# EAGLE schematic ft231x-breakout-v11 (EAGLE 8.6.3)
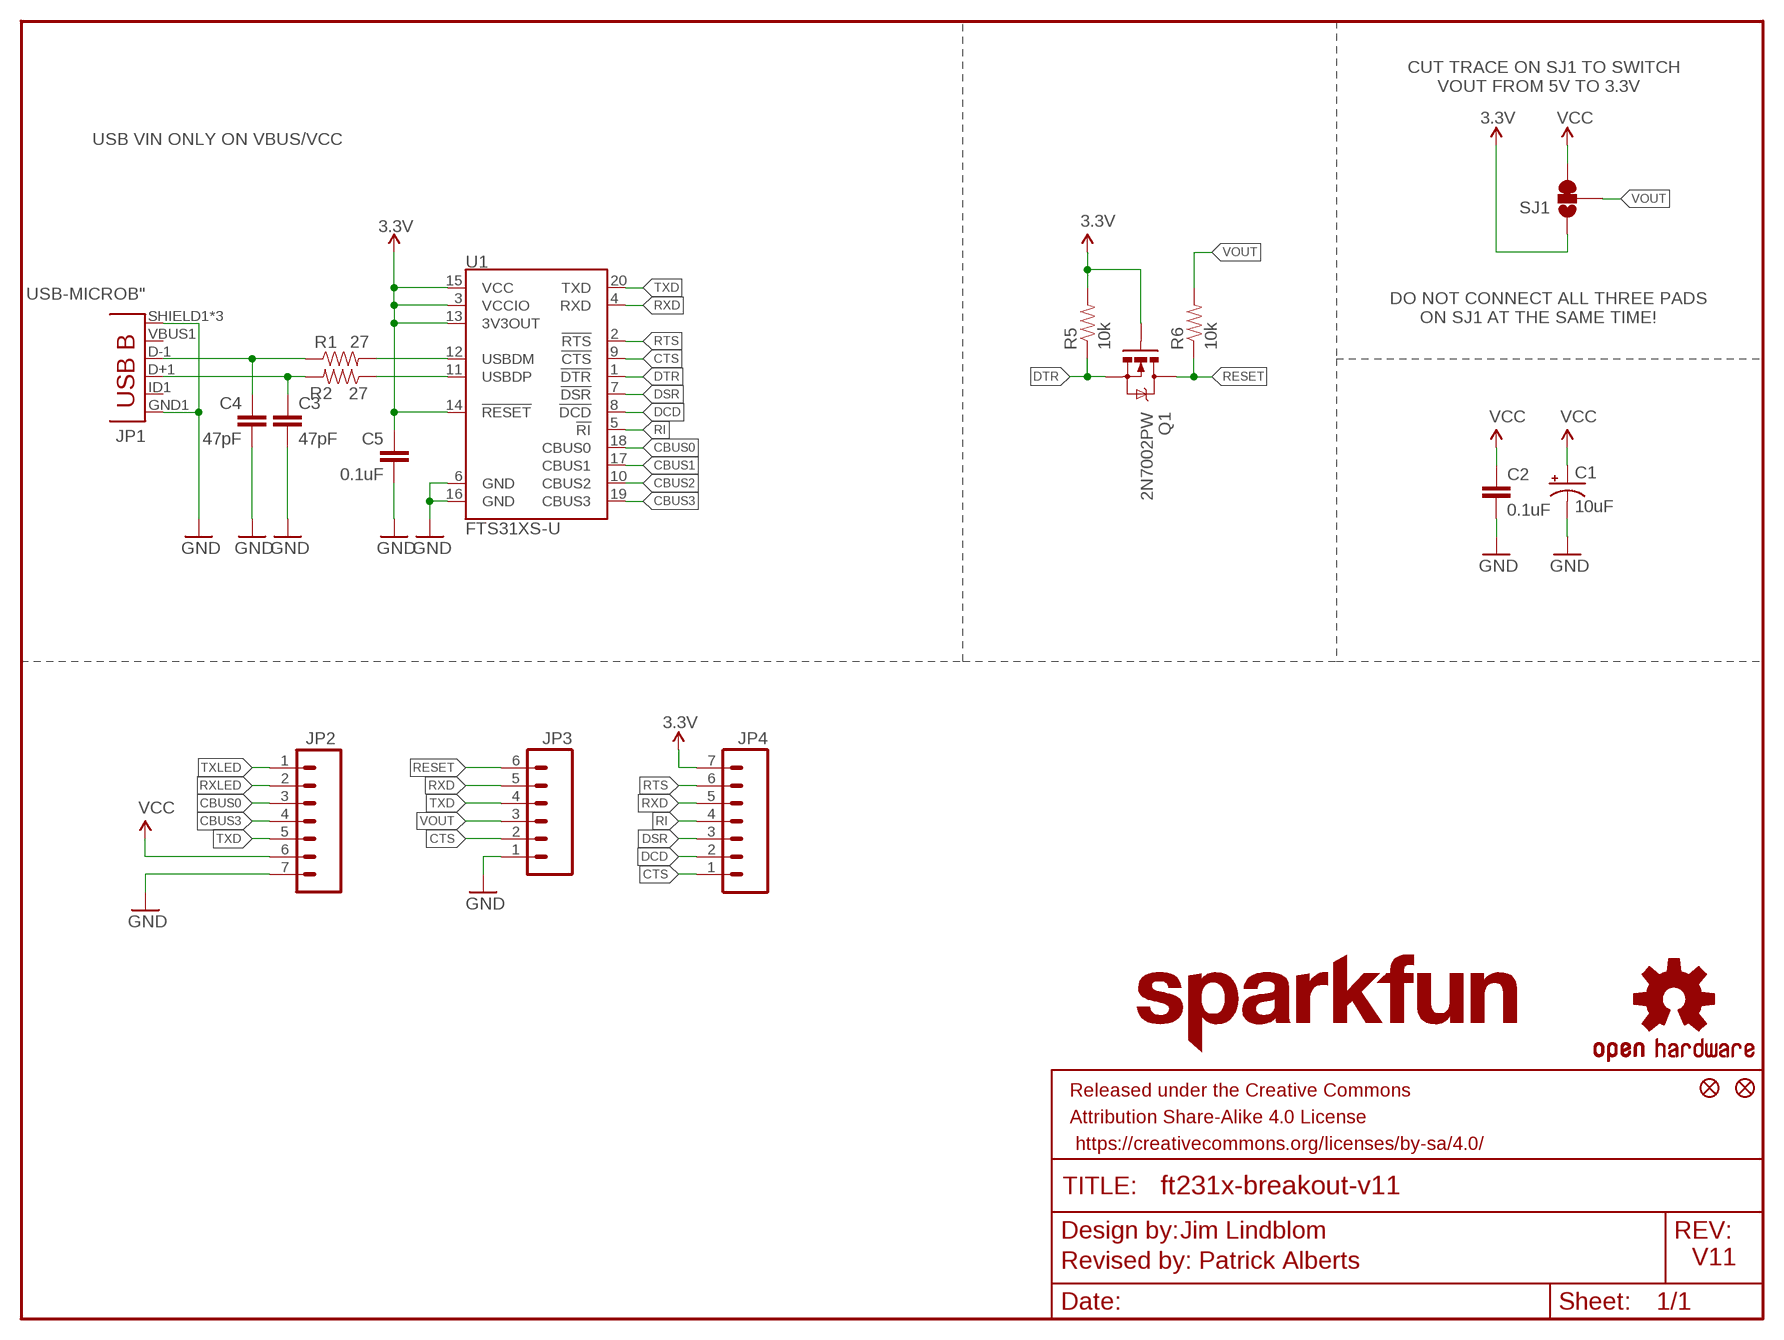
[diagram p0: schematic, sheet 1]

## Parts
C1  10uF  10UF-16V-10%(TANT)  [EIA3216]
C2  0.1uF  0.1UF-25V(+80/-20%)(0603)  [0603-CAP]
C3  47pF  47PF-50V-5%(0603)  [0603-CAP]
C4  47pF  47PF-50V-5%(0603)  [0603-CAP]
C5  0.1uF  0.1UF-25V(+80/-20%)(0603)  [0603-CAP]
FRAME1  FRAME-LETTER  [CREATIVE_COMMONS]
JP1  USB-MICROB"  [USB-B-MICRO-SMD_V03]
JP2  M07NO_SILK  [1X07_NO_SILK]
JP3  M06NO_SILK_FEMALE_PTH  [1X06_NO_SILK]
JP4  M07NO_SILK  [1X07_NO_SILK]
JP5  FIDUCIAL1X2  [FIDUCIAL-1X2]
JP6  FIDUCIAL1X2  [FIDUCIAL-1X2]
LOGO1  SFE_LOGO_NAME.1_INCH  [SFE_LOGO_NAME_.1]
Q1  2N7002PW  MOSFET-NCHANNEL2N7002PW  [SOT323]
R1  27  27OHM1/10W1%(0603)0603-RES  [0603-RES]
R2  27  27OHM1/10W1%(0603)0603-RES  [0603-RES]
R5  10k  10KOHM1/10W1%(0603)0603  [0603-RES@1]
R6  10k  10KOHM1/10W1%(0603)0603  [0603-RES@1]
SJ1  SOLDERJUMPER_2WAYS  [SJ_3]
U1  FTS31XS-U  FT231XS  [SSOP20_L]
U$1  OSHW-LOGOS  [OSHW-LOGO-S]

## Nets
3.3V: C5.1 JP4.7 Q1.1(G) R5.2 SJ1.1 U1.3(VCCIO) U1.13(3V3OUT) U1.14(!RESET) U1.15(VCC)
CBUS0: JP2.3 U1.18(CBUS0)
CBUS3: JP2.4 U1.19(CBUS3)
CTS: JP3.2 JP4.1 U1.9(!CTS)
DCD: JP4.2 U1.8(!DCD)
DSR: JP4.3 U1.7(!DSR)
DTR: Q1.2(S) R5.1 U1.1(!DTR)
GND: C1.C(-) C2.2 C3.2 C4.2 C5.2 JP1.GND1(GND) JP1.SHIELD1(SHIELD) JP1.SHIELD2(SHIELD) JP1.SHIELD3(SHIELD) JP2.7 JP3.1 U1.6(GND) U1.16(GND)
N$1: R1.2 U1.12(USBDM)
N$2: R2.1 U1.11(USBDP)
N$3: C3.1 JP1.D+1(D+) R2.2
N$4: C4.1 JP1.D-1(D-) R1.1
N$5: U1.17(CBUS1)
N$6: U1.10(CBUS2)
RESET: JP3.6 Q1.3(D) R6.1
RI: JP4.4 U1.5(!RI)
RTS: JP4.6 U1.2(!RTS)
RXD: JP3.5 JP4.5 U1.4(RXD)
RXLED: JP2.2
TXD: JP2.5 JP3.4 U1.20(TXD)
TXLED: JP2.1
VCC: C1.A(+) C2.1 JP2.6 SJ1.3
VOUT: JP3.3 R6.2 SJ1.2
Unconnected: JP1.ID1(USBID) JP1.VBUS1(VBUS)

## Notes on the sheet
- CUT TRACE ON SJ1 TO SWITCH
        VOUT FROM 5V TO 3.3V
- USB VIN ONLY ON VBUS/VCC
- DO NOT CONNECT ALL THREE PADS
        ON SJ1 AT THE SAME TIME!
- Jim Lindblom
- Revised by: Patrick Alberts | V11

## Library data of the parts
C1 = SparkFun-Capacitors:10UF-16V-10%(TANT): CAP-00811 1206/EIA-3216 Tantalum capacitor; PROD_ID: CAP-00811
C2 C5 = SparkFun-Capacitors:0.1UF-25V(+80/-20%)(0603): CAP-00810 Ceramic Standard decoupling cap; PROD_ID: CAP-00810
C3 C4 = SparkFun-Capacitors:47PF-50V-5%(0603): CAP-08913; PROD_ID: CAP-08913
FRAME1 = SparkFun-Aesthetics:FRAME-LETTER: Schematic Frame Standard 8.5x11 US Letter frame
JP1 = SparkFun-Connectors:USB-MICROB; PROD_ID: CONN-11752
JP2 JP4 = SparkFun-Connectors:M07: Header 7 Standard 7-pin 0.1" header. Use with straight break away headers (SKU : PRT-00116), right angle break away headers (PRT-00553), swiss pins (PRT-00743), machine pins (PRT-00117), and female headers (PRT-00115). NOTES ON THE VARIANTS LOCK and LOCK_LONGPADS... This footprint was designed to help hold the alignment of a through-hole component (i.e. 7-pin header) while soldering it into place. You may notice that each hole has been shifted either up or down by 0.005 of an inch from it's more standard position (which is usually a perfectly straight line). This slight alteration caused the pins (the squares in the middle) to touch the edges of the holes. Because they are alternating, it causes a "brace" to hold the header in place. 0.005 has proven to be the perfect amount of "off-center" position when using our standard breakaway headers. Although looks a little odd when you look at the bare footprint, once you have a header in there, the alteration is very hard to notice. Also, if you push a header all the way into place, it is covered up entirely on the bottom side. This idea of altering the position of holes to aid alignment will be further integrated into the Sparkfun Library for other footprints. It can help hold any component with 3 or more connection pins.
JP3 = SparkFun-Connectors:M06: Header 6 Standard 6-pin 0.1" header. Use with straight break away headers (SKU : PRT-00116), right angle break away headers (PRT-00553), swiss pins (PRT-00743), machine pins (PRT-00117), and female headers (PRT-00115). Molex polarized connector foot print use with SKU : PRT-08094 with associated crimp pins and housings. NOTES ON THE VARIANTS LOCK and LOCK_LONGPADS... This footprint was designed to help hold the alignment of a through-hole component (i.e. 6-pin header) while soldering it into place. You may notice that each hole has been shifted either up or down by 0.005 of an inch from it's more standard position (which is a perfectly straight line). This slight alteration caused the pins (the squares in the middle) to touch the edges of the holes. Because they are alternating, it causes a "brace" to hold the component in place. 0.005 has proven to be the perfect amount of "off-center" position when using our standard breakaway headers. Although looks a little odd when you look at the bare footprint, once you have a header in there, the alteration is very hard to notice. Also,if you push a header all the way into place, it is covered up entirely on the bottom side. This idea of altering the position of holes to aid alignment will be further integrated into the Sparkfun Library for other footprints. It can help hold any component with 3 or more connection pins.; PROD_ID: CONN-08437
JP5 JP6 = SparkFun-Aesthetics:FIDUCIAL: Fiducial Alignment Points Various fiducial points for machine vision alignment.
LOGO1 = SparkFun-Aesthetics:SFE_LOGO_NAME: SFE Logo, name only This is the SparkFun name logo. The logo on the schematic will always be the same size; the package variant is the height of the flame part of the logo (or the height the flame would be, if it were drawn). Default layer for the logo on the board is tSilk.
Q1 = SparkFun-DiscreteSemi:MOSFET-NCHANNEL: Common NMOSFET Parts MFG P/N Store ID Prod ID FDD8780 TRANS-09984 SI7820DN TRANS-11055 FDS6630A IC-08089 2N7002PW TRANS-11151 FQP30N06L COM-10213 TRANS-10060 BSS123LT1G TRANS-08345 BSS138 TRANS-00830 BS170 2N7000; PROD_ID: TRANS-11151
R1 R2 = SparkFun-Resistors:27OHM1/10W1%(0603): RES-09334; PROD_ID: RES-09334
R5 R6 = SparkFun-Resistors:10KOHM1/10W1%(0603): RES-00824; PROD_ID: RES-00824; VALUE: 10K
SJ1 = SparkFun-Passives:SOLDERJUMPER_2WAY: Solder Jumper 2 way solder jumper
U1 = SparkFun-DigitalIC:FT231X: FTDI FT231X Full Speed USB to Full-handshake UART This USB2.0 Full Speed IC offers a compact bridge to full handshake UART interfaces. The device is a UART, capable of operating up to 3MBaud, with low power consumption (8mA). The FT231X includes the complete FT-X series feature set and enables USB to be added into a system design quickly and easily over a UART interface.; PROD_ID: IC-11524
U$1 = SparkFun-Aesthetics:OSHW-LOGO: Open Source Hardware Logo This logo indicates the piece of hardware it is found on incorporates a OSHW license and/or adheres to the definition of open source hardware found here: http://freedomdefined.org/OSHW